# Altium schematic sheet TempSensor.SchDoc
size A4; SheetNumber: 7; SheetTotal: 11
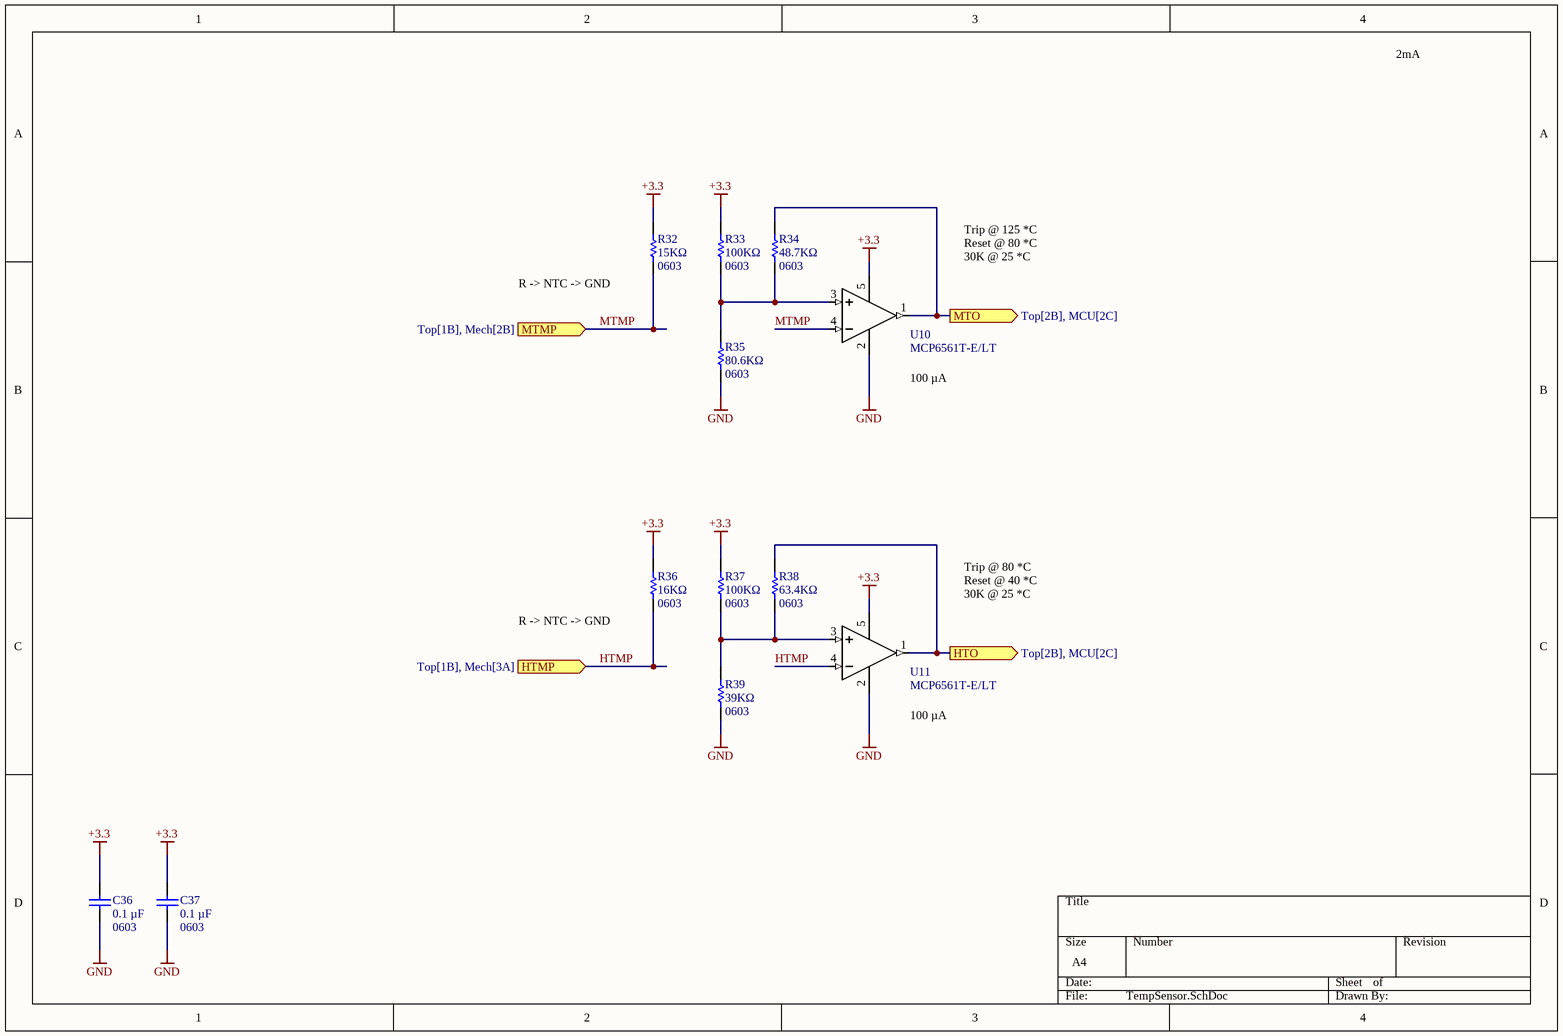
[diagram p0: TempSensor.SchDoc]

## Parts
C36  value 0.1 µF  [0603]  (hidden comment: GRM188R72A104MA35J)
C37  value 0.1 µF  [0603]  (hidden comment: GRM188R72A104MA35J)
R32  value 15KΩ  [0603]  (hidden comment: RMCF0603FG15K0)
R33  value 100KΩ  [0603]  (hidden comment: RMCF0603FG100K)
R34  value 48.7KΩ  [0603]  (hidden comment: RMCF0603FT48K7)
R35  value 80.6KΩ  [0603]  (hidden comment: RMCF0603FT80K6)
R36  value 16KΩ  [0603]  (hidden comment: RMCF0603FG16K0)
R37  value 100KΩ  [0603]  (hidden comment: RMCF0603FG100K)
R38  value 63.4KΩ  [0603]  (hidden comment: RMCF0603FT63K4)
R39  value 39KΩ  [0603]  (hidden comment: RMCF0603FG39K0)
U10  MCP6561T-E/LT  [SC-70-5]
U11  MCP6561T-E/LT  [SC-70-5]

## Ports
HTMP (in, see Top[1B], Mech[3A]), HTO (out, see Top[2B], MCU[2C]), MTMP (in, see Top[1B], Mech[2B]), MTO (out, see Top[2B], MCU[2C])

## Nets
+3.3: C36.1 C37.1 R32.2 R33.2 R36.2 R37.2 U10.5(V+) U11.5(V+)
GND: C36.2 C37.2 R35.1 R39.1 U10.2(V-) U11.2(V-)
HTMP: R36.1 U11.4(-IN) ; port HTMP
HTO: R38.2 U11.1(OUT) ; port HTO
MTMP: R32.1 U10.4(-IN) ; port MTMP
MTO: R34.2 U10.1(OUT) ; port MTO
NetR33_1: R33.1 R34.1 R35.2 U10.3(+IN)
NetR37_1: R37.1 R38.1 R39.2 U11.3(+IN)

## Notes on the sheet
- 2mA
- (near R32) R -> NTC -> GND
- Trip @ 125 *C
  Reset @ 80 *C
  30K @ 25 *C
- (near U10) 100 µA
- (near R36) R -> NTC -> GND
- Trip @ 80 *C
  Reset @ 40 *C
  30K @ 25 *C
- (near U11) 100 µA

## Library data of the parts
C36 C37 = GRM188R72A104MA35J: 0.1 µF ±20% 100V Ceramic Capacitor X7R 0603 (1608 Metric); Case: 0603; Tolerance: ±20%; Temperature Coefficient: X7R; Voltage: 100V
R32 = RMCF0603FG15K0: 15 kOhms ±1% 0.1W, 1/10W Chip Resistor 0603 (1608 Metric) Automotive AEC-Q200 Thick Film; Case: 0603; Tolerance: 1%; Power: 0.1W
R33 R37 = RMCF0603FG100K: 100 kOhms ±1% 0.1W, 1/10W Chip Resistor 0603 (1608 Metric) Automotive AEC-Q200 Thick Film; Case: 0603; Tolerance: 1%; Power: 0.1W
R34 = RMCF0603FT48K7: 48.7 kOhms ±1% 0.1W, 1/10W Chip Resistor 0603 (1608 Metric) Automotive AEC-Q200 Thick Film; Case: 0603; Tolerance: 1%; Power: 0.1W
R35 = RMCF0603FT80K6: 80.6 kOhms ±1% 0.1W, 1/10W Chip Resistor 0603 (1608 Metric) Automotive AEC-Q200 Thick Film; Case: 0603; Tolerance: 1%; Power: 0.1W
R36 = RMCF0603FG16K0: 16 kOhms ±1% 0.1W, 1/10W Chip Resistor 0603 (1608 Metric) Automotive AEC-Q200 Thick Film; Case: 0603; Tolerance: 1%; Power: 0.1W
R38 = RMCF0603FT63K4: 63.4 kOhms ±1% 0.1W, 1/10W Chip Resistor 0603 (1608 Metric) Automotive AEC-Q200 Thick Film; Case: 0603; Tolerance: 1%; Power: 0.1W
R39 = RMCF0603FG39K0: 39 kOhms ±1% 0.1W, 1/10W Chip Resistor 0603 (1608 Metric) Automotive AEC-Q200 Thick Film; Case: 0603; Tolerance: 1%; Power: 0.1W
U10 U11 = MCP6561T-E/LT: Comparator General Purpose CMOS, Push-Pull, Rail-to-Rail, TTL SC-70-5